# EAGLE schematic Mainboard - Prototyp 2 (EAGLE 7.2.0)
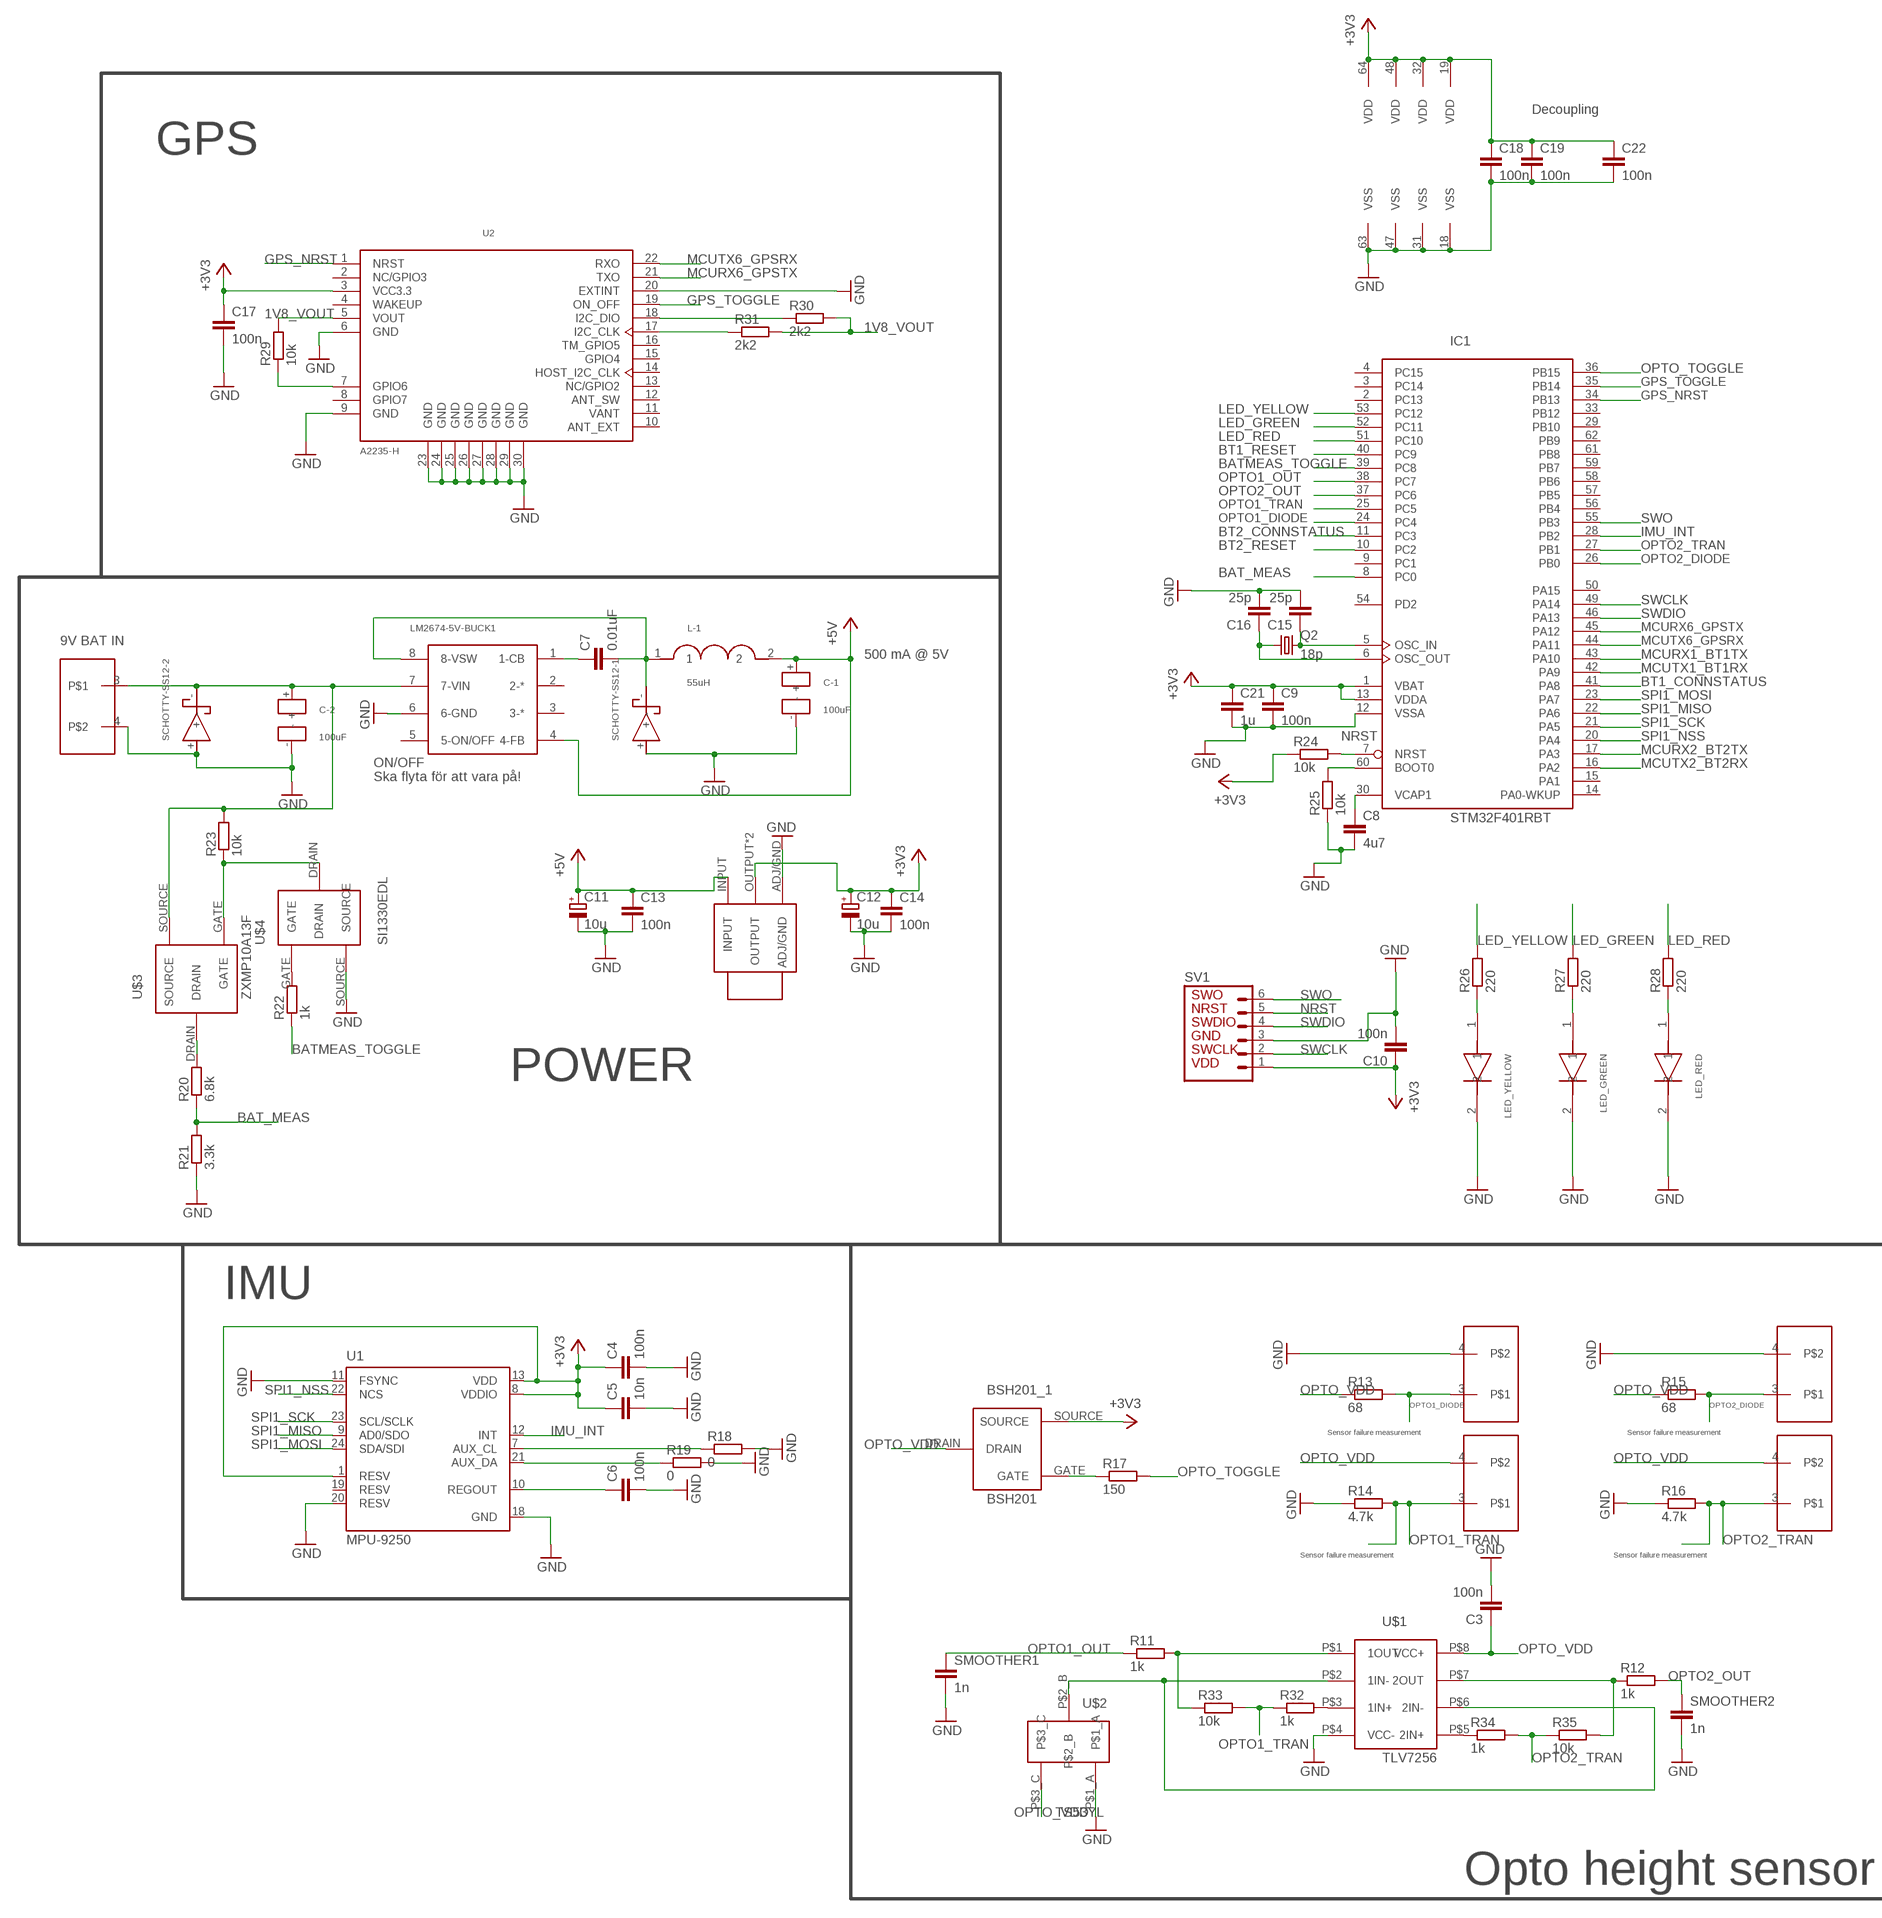
[diagram p0: schematic, sheet 1, part 1 of 2]
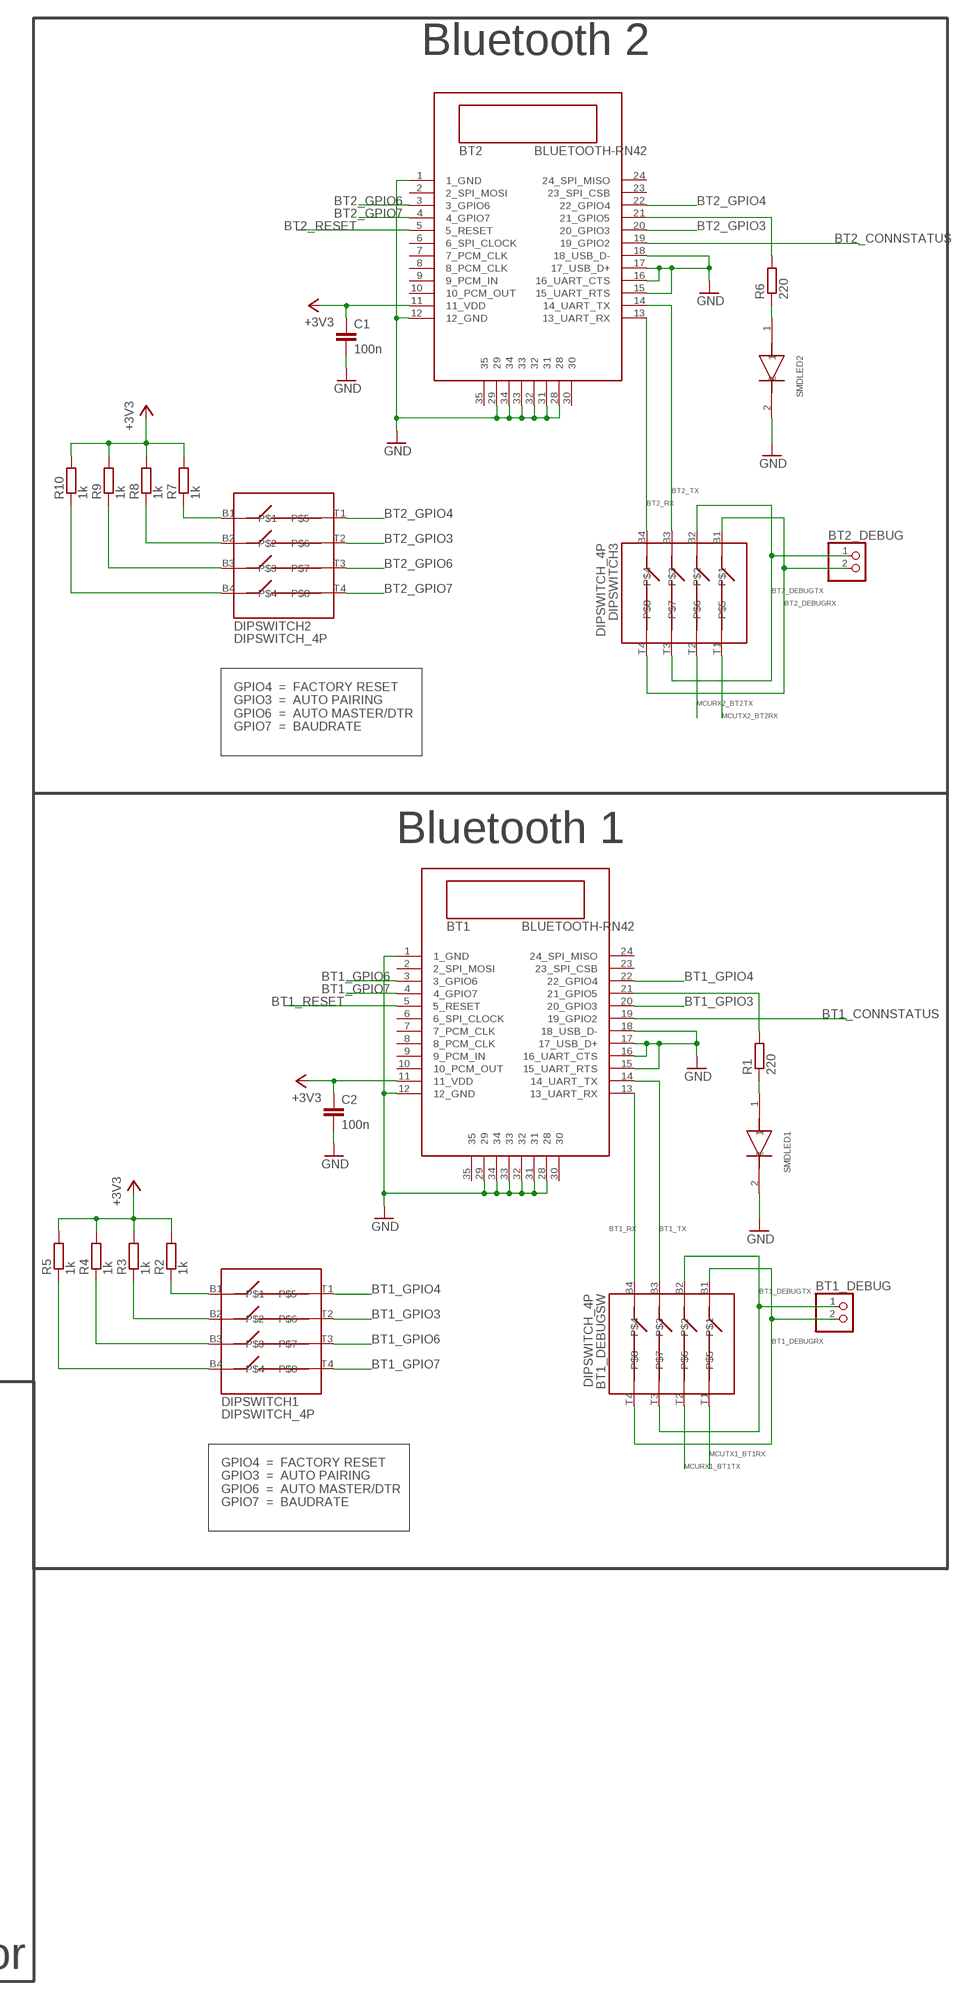
[diagram p1: schematic, sheet 1, part 2 of 2]

## Parts
BSH201_1  BSH201  [P-CHANNEL]
BT1  BLUETOOTH-RN42  [RN42]
BT1_DEBUG  PINHD-1X2  [1X02]
BT1_DEBUGSW  DIPSWITCH_4P  [DIPSWITCH4P]
BT2  BLUETOOTH-RN42  [RN42]
BT2_DEBUG  PINHD-1X2  [1X02]
C1  100n  C-EUC0805  [C0805]
C2  100n  C-EUC0805  [C0805]
C3  100n  C-EUC0805  [C0805]
C4  100n  C-EUC0805  [C0805]
C5  10n  C-EUC0805  [C0805]
C6  100n  C-EUC0805  [C0805]
C7  0.01uF  C-EUC0805  [C0805]
C8  4u7  C-EUC0805  [C0805]
C9  100n  C-EUC0805  [C0805]
C10  100n  C-EUC0805  [C0805]
C11  10u  CPOL-EU153CLV-0505  [153CLV-0505]
C12  10u  CPOL-EU153CLV-0505  [153CLV-0505]
C13  100n  C-EUC0805  [C0805]
C14  100n  C-EUC0805  [C0805]
C15  25p  C-EUC0805  [C0805]
C16  25p  C-EUC0805  [C0805]
C17  100n  C-EUC0805  [C0805]
C18  100n  C-EUC0805  [C0805]
C19  100n  C-EUC0805  [C0805]
C21  1u  C-EUC0805  [C0805]
C22  100n  C-EUC0805  [C0805]
C-1  100uF  PANASONIC-CAP  [CAP-6.3MM-DIA]
C-2  100uF  PANASONIC-CAP  [CAP-6.3MM-DIA]
DIPSWITCH1  DIPSWITCH_4P  [DIPSWITCH4P]
DIPSWITCH2  DIPSWITCH_4P  [DIPSWITCH4P]
DIPSWITCH3  DIPSWITCH_4P  [DIPSWITCH4P]
IC1  STM32F401RBT  [LQFP64]
L-1  55uH  55UH-INDUKTOR  [INDUCTOR]
LED_GREEN  SMD_LED  [SMD_LED_CUSTOM]
LED_RED  SMD_LED  [SMD_LED_CUSTOM]
LED_YELLOW  SMD_LED  [SMD_LED_CUSTOM]
LM1117-1  LM1117  [LM1117]
LM2674-5V-BUCK1  LM2674-5VBUCK  [LM2674]
Q2  18p  CRYSTALHC49UP  [HC49UP]
R1  220  R-EU_R0805  [R0805]
R2  1k  R-EU_R0805  [R0805]
R3  1k  R-EU_R0805  [R0805]
R4  1k  R-EU_R0805  [R0805]
R5  1k  R-EU_R0805  [R0805]
R6  220  R-EU_R0805  [R0805]
R7  1k  R-EU_R0805  [R0805]
R8  1k  R-EU_R0805  [R0805]
R9  1k  R-EU_R0805  [R0805]
R10  1k  R-EU_R0805  [R0805]
R11  1k  R-EU_R0805  [R0805]
R12  1k  R-EU_R0805  [R0805]
R13  68  R-EU_R0805  [R0805]
R14  4.7k  R-EU_R0805  [R0805]
R15  68  R-EU_R0805  [R0805]
R16  4.7k  R-EU_R0805  [R0805]
R17  150  R-EU_R0805  [R0805]
R18  0  R-EU_R0805  [R0805]
R19  0  R-EU_R0805  [R0805]
R20  6.8k  R-EU_R0805  [R0805]
R21  3.3k  R-EU_R0805  [R0805]
R22  1k  R-EU_R0805  [R0805]
R23  10k  R-EU_R0805  [R0805]
R24  10k  R-EU_R0805  [R0805]
R25  10k  R-EU_R0805  [R0805]
R26  220  R-EU_R0805  [R0805]
R27  220  R-EU_R0805  [R0805]
R28  220  R-EU_R0805  [R0805]
R29  10k  R-EU_R0805  [R0805]
R30  2k2  R-EU_R0805  [R0805]
R31  2k2  R-EU_R0805  [R0805]
R32  1k  R-EU_R0805  [R0805]
R33  10k  R-EU_R0805  [R0805]
R34  1k  R-EU_R0805  [R0805]
R35  10k  R-EU_R0805  [R0805]
SCHOTTY-SS12-1  SCHOTTY-SS12  [SCHOTTY]
SCHOTTY-SS12-2  SCHOTTY-SS12  [SCHOTTY]
SKRUVPLINT_2P1  SKRUVPLINT_2P  [SKRUVPLINT_2P]
SKRUVPLINT_2P2  SKRUVPLINT_2P  [SKRUVPLINT_2P]
SKRUVPLINT_2P3  SKRUVPLINT_2P  [SKRUVPLINT_2P]
SKRUVPLINT_2P4  SKRUVPLINT_2P  [SKRUVPLINT_2P]
SKRUVPLINT_2P5  SKRUVPLINT_2P  [SKRUVPLINT_2P]
SMDLED1  SMD_LED  [SMD_LED_CUSTOM]
SMDLED2  SMD_LED  [SMD_LED_CUSTOM]
SMOOTHER1  1n  C-EUC0805  [C0805]
SMOOTHER2  1n  C-EUC0805  [C0805]
SV1  MA06-1  [MA06-1]
U1  MPU-9250  [QFN40P300X300X105-25N]
U2  A2235-H  [XCVR_A2235-H]
U$1  TLV7256  [VSSOP]
U$2  TS53YL  [POT]
U$3  ZXMP10A13F  [P-CHANNEL]
U$4  SI1330EDL  [SOT-323]

## Nets
1V8_VOUT: R29.2 R30.2 R31.2 U2.5(VOUT)
+3V3: BSH201_1.SOURCE BT1.11(11_VDD) BT2.11(11_VDD) C1.1 C2.1 C4.1 C5.1 C9.1 C10.1 C12.+ C14.1 C17.1 C18.1 C19.1 C21.1 C22.1 IC1.1(VBAT) IC1.13(VDDA) IC1.19(VDD) IC1.32(VDD) IC1.48(VDD) IC1.64(VDD) LM1117-1.OUTPUT LM1117-1.OUTPUT2(OUTPUT) R2.2 R3.2 R4.2 R5.2 R7.2 R8.2 R9.2 R10.2 R24.1 SV1.1 U1.1(RESV) U1.8(VDDIO) U1.13(VDD) U2.3(VCC3.3)
+5V: C11.+ C13.1 C-1.+ L-1.2 LM1117-1.INPUT LM2674-5V-BUCK1.4(4-FB)
BAT_MEAS: IC1.8(PC0) R20.1 R21.2
BATMEAS_TOGGLE: IC1.39(PC8) R22.1
BATSUP: C-2.+ LM2674-5V-BUCK1.7(7-VIN) R23.2 SCHOTTY-SS12-2.- SKRUVPLINT_2P5.3 U$3.SOURCE
BT1_CONNSTATUS: BT1.19(19_GPIO2) IC1.41(PA8)
BT1_DEBUGRX: BT1_DEBUG.2 BT1_DEBUGSW.B1 BT1_DEBUGSW.T4
BT1_DEBUGTX: BT1_DEBUG.1 BT1_DEBUGSW.B2 BT1_DEBUGSW.T3
BT1_GPIO3: BT1.20(20_GPIO3) DIPSWITCH1.T2
BT1_GPIO4: BT1.22(22_GPIO4) DIPSWITCH1.T1
BT1_GPIO6: BT1.3(3_GPIO6) DIPSWITCH1.T3
BT1_GPIO7: BT1.4(4_GPIO7) DIPSWITCH1.T4
BT1_RESET: BT1.5(5_RESET) IC1.40(PC9)
BT1_RX: BT1.13(13_UART_RX) BT1_DEBUGSW.B4
BT1_TX: BT1.14(14_UART_TX) BT1_DEBUGSW.B3
BT2_CONNSTATUS: BT2.19(19_GPIO2) IC1.11(PC3)
BT2_DEBUGRX: BT2_DEBUG.2 DIPSWITCH3.B1 DIPSWITCH3.T4
BT2_DEBUGTX: BT2_DEBUG.1 DIPSWITCH3.B2 DIPSWITCH3.T3
BT2_GPIO3: BT2.20(20_GPIO3) DIPSWITCH2.T2
BT2_GPIO4: BT2.22(22_GPIO4) DIPSWITCH2.T1
BT2_GPIO6: BT2.3(3_GPIO6) DIPSWITCH2.T3
BT2_GPIO7: BT2.4(4_GPIO7) DIPSWITCH2.T4
BT2_RESET: BT2.5(5_RESET) IC1.10(PC2)
BT2_RX: BT2.13(13_UART_RX) DIPSWITCH3.B4
BT2_TX: BT2.14(14_UART_TX) DIPSWITCH3.B3
GND: BT1.1(1_GND) BT1.12(12_GND) BT1.15(15_UART_RTS) BT1.16(16_UART_CTS) BT1.17(17_USB_D+) BT1.18(18_USB_D-) BT1.28 BT1.29 BT1.31 BT1.32 BT1.33 BT1.34 BT2.1(1_GND) BT2.12(12_GND) BT2.15(15_UART_RTS) BT2.16(16_UART_CTS) BT2.17(17_USB_D+) BT2.18(18_USB_D-) BT2.28 BT2.29 BT2.31 BT2.32 BT2.33 BT2.34 C1.2 C2.2 C3.2 C4.2 C5.2 C6.2 C8.2 C9.2 C10.2 C11.- C12.- C13.2 C14.2 C15.2 C16.2 C17.2 C18.2 C19.2 C21.2 C22.2 C-1.- C-2.- IC1.12(VSSA) IC1.18(VSS) IC1.31(VSS) IC1.47(VSS) IC1.63(VSS) LED_GREEN.2 LED_RED.2 LED_YELLOW.2 LM1117-1.ADJ/GND LM2674-5V-BUCK1.6(6-GND) R14.1 R16.1 R18.2 R19.2 R21.1 R25.1 SCHOTTY-SS12-1.+ SCHOTTY-SS12-2.+ SKRUVPLINT_2P1.4 SKRUVPLINT_2P3.4 SKRUVPLINT_2P5.4 SMDLED1.2 SMDLED2.2 SMOOTHER1.2 SMOOTHER2.2 SV1.3 U1.11(FSYNC) U1.18(GND) U1.20(RESV) U2.6(GND) U2.9(GND) U2.20(EXTINT) U2.23(GND) U2.24(GND) U2.25(GND) U2.26(GND) U2.27(GND) U2.28(GND) U2.29(GND) U2.30(GND) U$1.P$4(VCC-) U$2.P$1_A U$4.SOURCE
GPS_NRST: IC1.34(PB13) U2.1(NRST)
GPS_TOGGLE: IC1.35(PB14) U2.19(ON_OFF)
IMU_INT: IC1.28(PB2) U1.12(INT)
LED_GREEN: IC1.52(PC11) R27.2
LED_RED: IC1.51(PC10) R28.2
LED_YELLOW: IC1.53(PC12) R26.2
MCURX1_BT1TX: BT1_DEBUGSW.T2 IC1.43(PA10)
MCURX2_BT2TX: DIPSWITCH3.T2 IC1.17(PA3)
MCURX6_GPSTX: IC1.45(PA12) U2.21(TXO)
MCUTX1_BT1RX: BT1_DEBUGSW.T1 IC1.42(PA9)
MCUTX2_BT2RX: DIPSWITCH3.T1 IC1.16(PA2)
MCUTX6_GPSRX: IC1.44(PA11) U2.22(RXO)
N$1: BT1.21(21_GPIO5) R1.2
N$2: DIPSWITCH1.B1 R2.1
N$3: DIPSWITCH1.B2 R3.1
N$4: DIPSWITCH1.B3 R4.1
N$5: DIPSWITCH1.B4 R5.1
N$6: BT2.21(21_GPIO5) R6.2
N$7: DIPSWITCH2.B1 R7.1
N$8: DIPSWITCH2.B2 R8.1
N$9: DIPSWITCH2.B3 R9.1
N$10: DIPSWITCH2.B4 R10.1
N$11: R6.1 SMDLED2.1
N$12: R1.1 SMDLED1.1
N$13: R11.2 R33.1 U$1.P$1(1OUT)
N$14: U$1.P$2(1IN-) U$1.P$6(2IN-) U$2.P$2_B
N$15: R12.1 R35.2 U$1.P$7(2OUT)
N$16: R29.1 U2.7(GPIO6)
N$17: R30.1 U2.18(I2C_DIO)
N$18: BSH201_1.GATE R17.1
N$19: C6.1 U1.10(REGOUT)
N$20: R18.1 U1.7(AUX_CL)
N$21: R19.1 U1.21(AUX_DA)
N$22: C7.1 LM2674-5V-BUCK1.1(1-CB)
N$23: R20.2 U$3.DRAIN
N$24: R22.2 U$4.GATE
N$25: R23.1 U$3.GATE U$4.DRAIN
N$26: C8.1 IC1.30(VCAP1)
N$27: IC1.60(BOOT0) R25.2
N$28: C15.1 IC1.5(OSC_IN) Q2.2
N$29: C16.1 IC1.6(OSC_OUT) Q2.1
N$30: LED_YELLOW.1 R26.1
N$31: LED_GREEN.1 R27.1
N$32: R31.1 U2.17(I2C_CLK)
N$33: LED_RED.1 R28.1
N$34: R32.2 U$1.P$3(1IN+)
N$35: R34.1 U$1.P$5(2IN+)
NRST: IC1.7(NRST) R24.2 SV1.5
OPTO1_DIODE: IC1.24(PC4) R13.2 SKRUVPLINT_2P1.3
OPTO1_OUT: IC1.38(PC7) R11.1 SMOOTHER1.1
OPTO1_TRAN: IC1.25(PC5) R14.2 R32.1 R33.2 SKRUVPLINT_2P2.3
OPTO2_DIODE: IC1.26(PB0) R15.2 SKRUVPLINT_2P3.3
OPTO2_OUT: IC1.37(PC6) R12.2 SMOOTHER2.1
OPTO2_TRAN: IC1.27(PB1) R16.2 R34.2 R35.1 SKRUVPLINT_2P4.3
OPTO_TOGGLE: IC1.36(PB15) R17.2
OPTO_VDD: BSH201_1.DRAIN C3.1 R13.1 R15.1 SKRUVPLINT_2P2.4 SKRUVPLINT_2P4.4 U$1.P$8(VCC+) U$2.P$3_C
SPI1_MISO: IC1.22(PA6) U1.9(AD0/SDO)
SPI1_MOSI: IC1.23(PA7) U1.24(SDA/SDI)
SPI1_NSS: IC1.20(PA4) U1.22(NCS)
SPI1_SCK: IC1.21(PA5) U1.23(SCL/SCLK)
SWCLK: IC1.49(PA14) SV1.2
SWDIO: IC1.46(PA13) SV1.4
SWO: IC1.55(PB3) SV1.6
VOUT: C7.2 L-1.1 LM2674-5V-BUCK1.8(8-VSW) SCHOTTY-SS12-1.-
Unconnected: BT1.2(2_SPI_MOSI) BT1.6(6_SPI_CLOCK) BT1.7(7_PCM_CLK) BT1.8(8_PCM_CLK) BT1.9(9_PCM_IN) BT1.10(10_PCM_OUT) BT1.23(23_SPI_CSB) BT1.24(24_SPI_MISO) BT1.30 BT1.35 BT2.2(2_SPI_MOSI) BT2.6(6_SPI_CLOCK) BT2.7(7_PCM_CLK) BT2.8(8_PCM_CLK) BT2.9(9_PCM_IN) BT2.10(10_PCM_OUT) BT2.23(23_SPI_CSB) BT2.24(24_SPI_MISO) BT2.30 BT2.35 IC1.2(PC13) IC1.3(PC14) IC1.4(PC15) IC1.9(PC1) IC1.14(PA0-WKUP) IC1.15(PA1) IC1.29(PB10) IC1.33(PB12) IC1.50(PA15) IC1.54(PD2) IC1.56(PB4) IC1.57(PB5) IC1.58(PB6) IC1.59(PB7) IC1.61(PB8) IC1.62(PB9) LM2674-5V-BUCK1.2(2-*) LM2674-5V-BUCK1.3(3-*) LM2674-5V-BUCK1.5(5-ON/OFF) U2.2(NC/GPIO3) U2.4(WAKEUP) U2.8(GPIO7) U2.10(ANT_EXT) U2.12(ANT_SW) U2.13(NC/GPIO2) U2.14(HOST_I2C_CLK) U2.15(GPIO4) U2.16(TM_GPIO5)

## Notes on the sheet
- Bluetooth 2
- Decoupling
- GPS
- GPIO4  =  FACTORY RESET
  GPIO3  =  AUTO PAIRING
  GPIO6  =  AUTO MASTER/DTR
  GPIO7  =  BAUDRATE
- 9V BAT IN
- 500 mA @ 5V | Bluetooth 1
- ON/OFF
  Ska flyta för att vara på!
- POWER
- IMU
- GPIO4  =  FACTORY RESET
  GPIO3  =  AUTO PAIRING
  GPIO6  =  AUTO MASTER/DTR
  GPIO7  =  BAUDRATE
- Sensor failure measurement | Sensor failure measurement
- Sensor failure measurement | Sensor failure measurement
- Opto height sensor

## Power pins joined to a net without a drawn wire
RESV: U1.19(RESV)
VANT: U2.11(VANT)

## Library data of the parts
BSH201_1 = BSH201:BSH201
BT1 BT2 = RN42:BLUETOOTH-RN42
BT1_DEBUG BT2_DEBUG = pinhead:PINHD-1X2: PIN HEADER
BT1_DEBUGSW DIPSWITCH1-DIPSWITCH3 = dipswitch4p_updated:DIPSWITCH_4P
C1-C10 C13-C19 C21 C22 SMOOTHER1 SMOOTHER2 = rcl:C-EU: CAPACITOR, European symbol
C11 C12 = rcl:CPOL-EU: POLARIZED CAPACITOR, European symbol
C-1 C-2 = panasonic-cap-100u:PANASONIC-CAP
IC1 = E7020E:STM32F401R*T: ARM 32-bit Cortex™-M3 CPU 84 MHz maximum frequency 128 to 256 Kbytes of Flash memory 64 kbytes of SRAM 50 GPIOs 1.7 to 3.6 V application supply
L-1 = inductor-55u:55UH-INDUKTOR
LED_GREEN LED_RED LED_YELLOW SMDLED1 SMDLED2 = greenled_smd:SMD_LED
LM1117-1 = LM1117-3v3_vreg:LM1117
LM2674-5V-BUCK1 = LM2674-5v-buck:LM2674-5VBUCK
Q2 = crystal:CRYSTAL: CRYSTAL; OC_FARNELL: unknown; OC_NEWARK: unknown
R1-R10 R26-R28 = resistor:R-EU_: RESISTOR, European symbol
R11-R25 R29-R35 = rcl:R-EU_: RESISTOR, European symbol
SCHOTTY-SS12-1 SCHOTTY-SS12-2 = schotty-SS12:SCHOTTY-SS12
SKRUVPLINT_2P1-SKRUVPLINT_2P5 = skruvplint2p_CTB0700:SKRUVPLINT_2P
SV1 = E7020E:MA06-1: PIN HEADER; OC_FARNELL: unknown; OC_NEWARK: unknown
U1 = MPU-9250:MPU-9250: GYRO/ACCEL/COMPASS/9-AXIS; AVAILABILITY: Good; DESCRIPTION: SMD Gyroscope/Accelerometer/Magnetometer Sensor; 9-AXIS; MF: InvenSense; MP: MPU-9250; PACKAGE: QFN-24 InvenSense; PRICE: 6.71 USD
U2 = A2235-H:A2235-H: Gps Module, Mini Outline w/ Ant; AVAILABILITY: Good; DESCRIPTION: Gps Module, Mini Outline w/ Ant; MF: Maestro Wireless; MP: A2235H; PACKAGE: None; PRICE: 15.70 USD
U$1 = TLV7256:TLV7256
U$2 = TS53YL:TS53YL
U$3 = ZXMP10A13F:ZXMP10A13F
U$4 = SI1330EDL:SI1330EDL